# Altium schematic sheet E17-PDU-6-LOAD_2.SchDoc
size A4
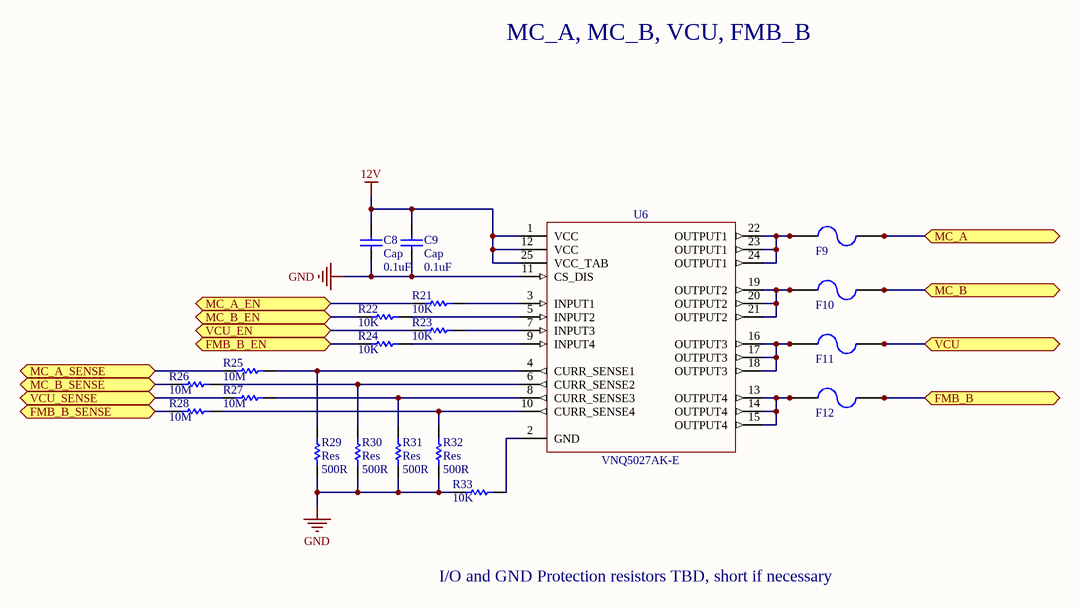
[diagram p0: E17-PDU-6-LOAD_2.SchDoc]

## Parts
C8  Cap  value 0.1uF  [C0805]
C9  Cap  value 0.1uF  [C0805]
F9  BK-6013  [BK-6013]  (value not drawn)
F10  BK-6013  [BK-6013]  (value not drawn)
F11  BK-6013  [BK-6013]  (value not drawn)
F12  BK-6013  [BK-6013]  (value not drawn)
R21  value 10K  [2012[0805]]  (hidden comment: Res)
R22  value 10K  [2012[0805]]  (hidden comment: Res)
R23  value 10K  [2012[0805]]  (hidden comment: Res)
R24  value 10K  [2012[0805]]  (hidden comment: Res)
R25  value 10M  [2012[0805]]  (hidden comment: Res)
R26  value 10M  [2012[0805]]  (hidden comment: Res)
R27  value 10M  [2012[0805]]  (hidden comment: Res)
R28  value 10M  [2012[0805]]  (hidden comment: Res)
R29  Res  value 500R  [2012[0805]]
R30  Res  value 500R  [2012[0805]]
R31  Res  value 500R  [2012[0805]]
R32  Res  value 500R  [2012[0805]]
R33  value 10K  [2012[0805]]  (hidden comment: Res)
U6  MFG_PN: VNQ5027AK-E  [PowerSSO-24]  (hidden comment: U_VNQ5027AK-E)

## Ports
FMB_B, FMB_B_EN, FMB_B_SENSE, MC_A, MC_A_EN, MC_A_SENSE, MC_B, MC_B_EN, MC_B_SENSE, VCU, VCU_EN, VCU_SENSE

## Nets
12V: C8.2 C9.2 U6.1(VCC) U6.12(VCC) U6.25(VCC_TAB)
GND: C8.1 C9.1 R29.1 R30.1 R31.1 R32.1 R33.2 U6.11(CS_DIS)
FMB_B: F12.3 F12.4 ; port FMB_B
FMB_B_EN: R24.2 ; port FMB_B_EN
FMB_B_SENSE: R28.2 ; port FMB_B_SENSE
MC_A: F9.3 F9.4 ; port MC_A
MC_A_EN: R21.2 ; port MC_A_EN
MC_A_SENSE: R25.2 ; port MC_A_SENSE
MC_B: F10.3 F10.4 ; port MC_B
MC_B_EN: R22.2 ; port MC_B_EN
MC_B_SENSE: R26.2 ; port MC_B_SENSE
VCU: F11.3 F11.4 ; port VCU
VCU_EN: R23.2 ; port VCU_EN
VCU_SENSE: R27.2 ; port VCU_SENSE
NetF9_1: F9.1 F9.2 U6.22(OUTPUT1) U6.23(OUTPUT1) U6.24(OUTPUT1)
NetF10_1: F10.1 F10.2 U6.19(OUTPUT2) U6.20(OUTPUT2) U6.21(OUTPUT2)
NetF11_1: F11.1 F11.2 U6.16(OUTPUT3) U6.17(OUTPUT3) U6.18(OUTPUT3)
NetF12_1: F12.1 F12.2 U6.13(OUTPUT4) U6.14(OUTPUT4) U6.15(OUTPUT4)
NetR21_1: R21.1 U6.3(INPUT1)
NetR22_1: R22.1 U6.5(INPUT2)
NetR23_1: R23.1 U6.7(INPUT3)
NetR24_1: R24.1 U6.9(INPUT4)
NetR25_1: R25.1 R29.2 U6.4(CURR_SENSE1)
NetR26_1: R26.1 R30.2 U6.6(CURR_SENSE2)
NetR27_1: R27.1 R31.2 U6.8(CURR_SENSE3)
NetR28_1: R28.1 R32.2 U6.10(CURR_SENSE4)
NetR33_1: R33.1 U6.2(GND)

## Notes on the sheet
- MC_A, MC_B, VCU, FMB_B
- I/O and GND Protection resistors TBD, short if necessary

## Library data of the parts
C8 C9 = Cap: Capacitor; Published: 8-Jun-2000; LatestRevisionDate: 17-Jul-2002; LatestRevisionNote: Re-released for DXP Platform.; PackageReference: C1206; Publisher: Altium Limited
F9-F12 = BK-6013: FUSE HOLDER BLADE PCB; Supplier 1: Digi-Key; Supplier Part Number 1: BK-6013-ND
R21-R33 = Res: Surface Mount Resistor; Published: 8-Jun-2000; LatestRevisionDate: 17-Jul-2002; LatestRevisionNote: Re-released for DXP Platform.; PackageReference: AXIAL-0.5; Publisher: Altium Limited
U6 = U_VNQ5027AK-E: LOAD CHANNEL HIGH SIDE 42 A 4 Channel; MFG: STmicroelectronics; Supplier 1: Digi-Key; Supplier Part Number 1: 497-11715-1-ND